# EAGLE design PCB-BI8-SE-E201 (EAGLE 7.5.0)

## Sheet 1 of 2
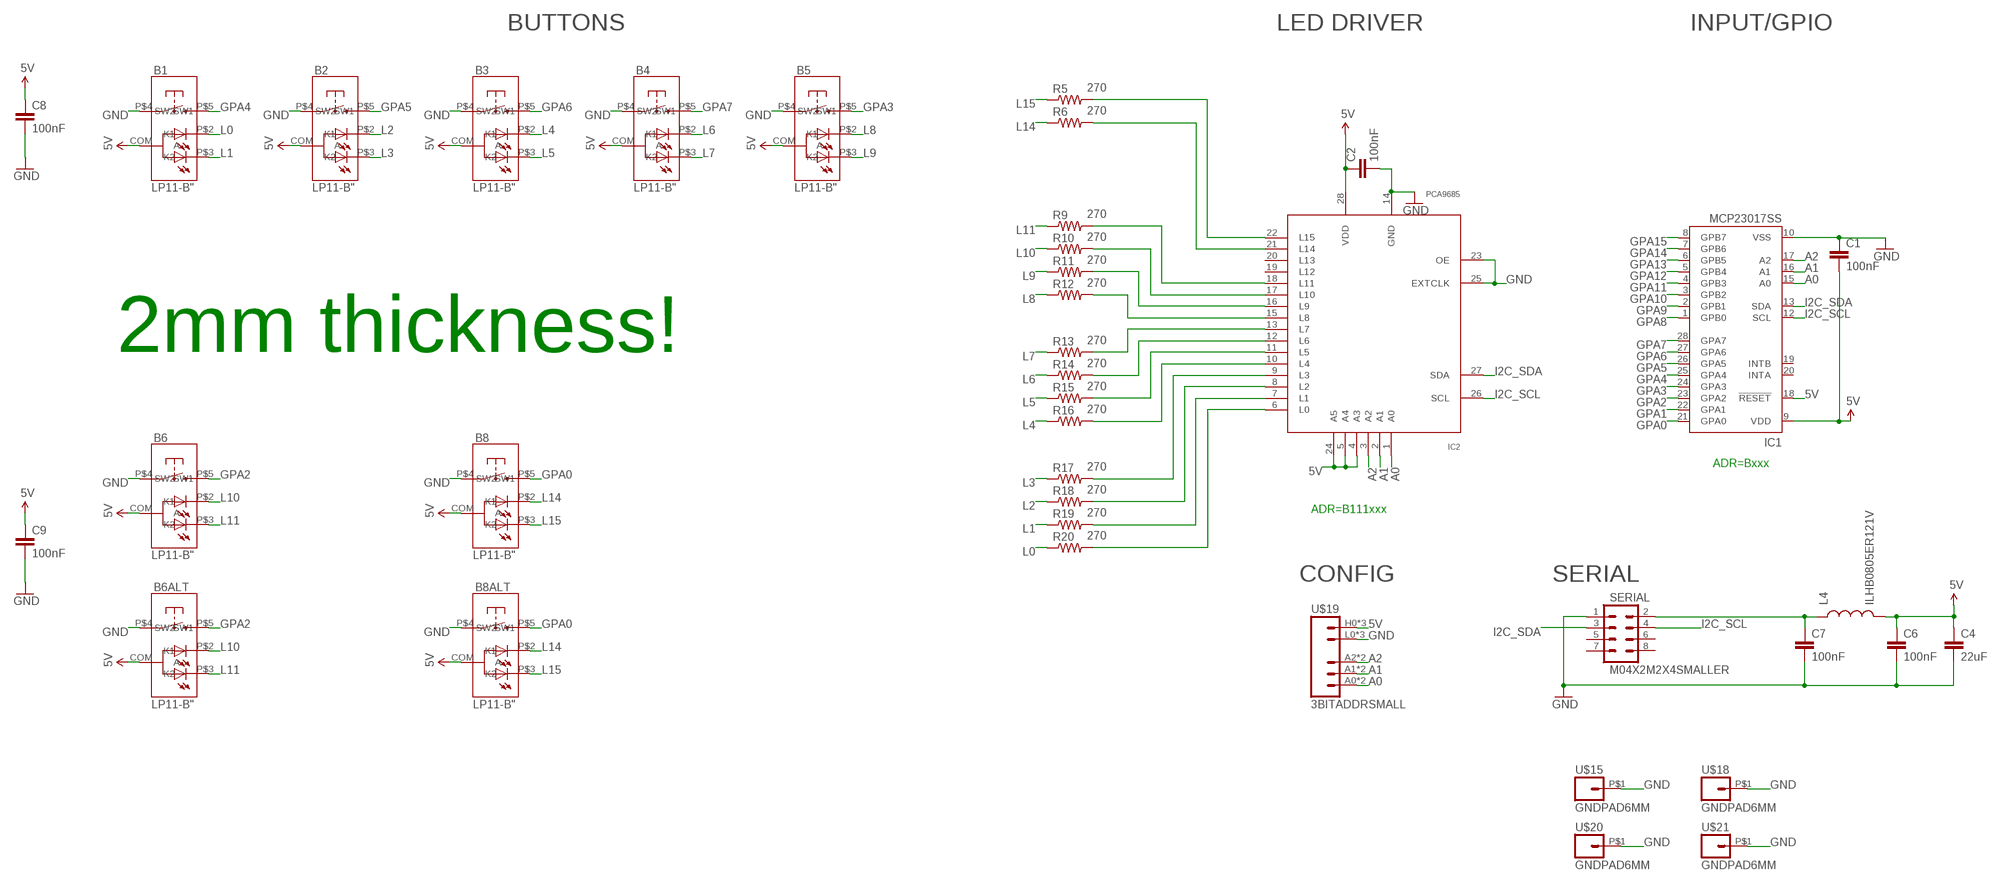
[diagram p0: schematic, sheet 1]

### Parts
B1  LP11-B"  [LP11]
B2  LP11-B"  [LP11]
B3  LP11-B"  [LP11]
B4  LP11-B"  [LP11]
B5  LP11-B"  [LP11]
B6  LP11-B"  [LP11]
B6ALT  LP11-B"  [LP11]
B8  LP11-B"  [LP11]
B8ALT  LP11-B"  [LP11]
C1  100nF  CAP0603-CAP  [0603-CAP]
C2  100nF  CAP0603-CAP  [0603-CAP]
C4  22uF  CAP0805  [0805]
C6  100nF  CAP0603-CAP  [0603-CAP]
C7  100nF  CAP0603-CAP  [0603-CAP]
C8  100nF  CAP0603-CAP  [0603-CAP]
C9  100nF  CAP0603-CAP  [0603-CAP]
IC1  MCP23017SS  [SSOP28]
IC2  PCA9685  [TSSOP28]
L4  ILHB0805ER121V  INDUCTOR0805  [0805]
R5  270  RESISTOR0603-RES  [0603-RES]
R6  270  RESISTOR0603-RES  [0603-RES]
R9  270  RESISTOR0603-RES  [0603-RES]
R10  270  RESISTOR0603-RES  [0603-RES]
R11  270  RESISTOR0603-RES  [0603-RES]
R12  270  RESISTOR0603-RES  [0603-RES]
R13  270  RESISTOR0603-RES  [0603-RES]
R14  270  RESISTOR0603-RES  [0603-RES]
R15  270  RESISTOR0603-RES  [0603-RES]
R16  270  RESISTOR0603-RES  [0603-RES]
R17  270  RESISTOR0603-RES  [0603-RES]
R18  270  RESISTOR0603-RES  [0603-RES]
R19  270  RESISTOR0603-RES  [0603-RES]
R20  270  RESISTOR0603-RES  [0603-RES]
SERIAL  M04X2M2X4SMALLER  [M2X4SMALLER]
U$15  GNDPAD6MM  [3.2MMPAD6MM]
U$18  GNDPAD6MM  [3.2MMPAD6MM]
U$19  3BITADDRSMALL  [3BITADDR_SMALL]
U$20  GNDPAD6MM  [3.2MMPAD6MM]
U$21  GNDPAD6MM  [3.2MMPAD6MM]

### Nets
5V [Power]: B1.COM(A) B2.COM(A) B3.COM(A) B4.COM(A) B5.COM(A) B6.COM(A) B6ALT.COM(A) B8.COM(A) B8ALT.COM(A) C1.2 C2.1 C4.1 C6.1 C8.1 C9.1 IC1.9(VDD) IC1.18(!RESET) IC2.4(A3) IC2.5(A4) IC2.24(A5) IC2.28(VDD) L4.2 U$19.H0(VCC) U$19.H1(VCC) U$19.H2(VCC)
A0: IC1.15(A0) IC2.1(A0) U$19.A0 U$19.AS0(A0)
A1: IC1.16(A1) IC2.2(A1) U$19.A1 U$19.AS1(A1)
A2: IC1.17(A2) IC2.3(A2) U$19.A2 U$19.AS2(A2)
GND [Power]: B1.P$4(SW1) B2.P$4(SW1) B3.P$4(SW1) B4.P$4(SW1) B5.P$4(SW1) B6.P$4(SW1) B6ALT.P$4(SW1) B8.P$4(SW1) B8ALT.P$4(SW1) C1.1 C2.2 C4.2 C6.2 C7.2 C8.2 C9.2 IC1.10(VSS) IC2.14(GND) IC2.23(OE) IC2.25(EXTCLK) SERIAL.1 U$15.P$1 U$18.P$1 U$19.L0(GND) U$19.L1(GND) U$19.L2(GND) U$20.P$1 U$21.P$1
GPA0: B8.P$5(SW2) B8ALT.P$5(SW2) IC1.21(GPA0)
GPA1: IC1.22(GPA1)
GPA2: B6.P$5(SW2) B6ALT.P$5(SW2) IC1.23(GPA2)
GPA3: B5.P$5(SW2) IC1.24(GPA3)
GPA4: B1.P$5(SW2) IC1.25(GPA4)
GPA5: B2.P$5(SW2) IC1.26(GPA5)
GPA6: B3.P$5(SW2) IC1.27(GPA6)
GPA7: B4.P$5(SW2) IC1.28(GPA7)
GPA8: IC1.1(GPB0)
GPA9: IC1.2(GPB1)
GPA10: IC1.3(GPB2)
GPA11: IC1.4(GPB3)
GPA12: IC1.5(GPB4)
GPA13: IC1.6(GPB5)
GPA14: IC1.7(GPB6)
GPA15: IC1.8(GPB7)
I2C_SCL: IC1.12(SCL) IC2.26(SCL) SERIAL.4
I2C_SDA: IC1.13(SDA) IC2.27(SDA) SERIAL.3
L0: B1.P$2(K1) R20.1
L1: B1.P$3(K2) R19.1
L2: B2.P$2(K1) R18.1
L3: B2.P$3(K2) R17.1
L4: B3.P$2(K1) R16.1
L5: B3.P$3(K2) R15.1
L6: B4.P$2(K1) R14.1
L7: B4.P$3(K2) R13.1
L8: B5.P$2(K1) R12.1
L9: B5.P$3(K2) R11.1
L10: B6.P$2(K1) B6ALT.P$2(K1) R10.1
L11: B6.P$3(K2) B6ALT.P$3(K2) R9.1
L14: B8.P$2(K1) B8ALT.P$2(K1) R6.1
L15: B8.P$3(K2) B8ALT.P$3(K2) R5.1
N$1 [Power]: C7.1 L4.1 SERIAL.2
N$4: IC2.13(L7) R13.2
N$5: IC2.12(L6) R14.2
N$7: IC2.11(L5) R15.2
N$9: IC2.10(L4) R16.2
N$10: IC2.9(L3) R17.2
N$11: IC2.8(L2) R18.2
N$12: IC2.7(L1) R19.2
N$19: IC2.6(L0) R20.2
N$20: IC2.15(L8) R12.2
N$21: IC2.16(L9) R11.2
N$22: IC2.17(L10) R10.2
N$23: IC2.18(L11) R9.2
N$26: IC2.21(L14) R6.2
N$27: IC2.22(L15) R5.2
Unconnected: IC1.19(INTB) IC1.20(INTA) IC2.19(L12) IC2.20(L13) SERIAL.5 SERIAL.6 SERIAL.7 SERIAL.8

### Notes on the sheet
- BUTTONS | LED DRIVER | INPUT/GPIO
- 2mm thickness!
- ADR=Bxxx
- ADR=B111xxx
- CONFIG | SERIAL

## Sheet 2 of 2

## Library data of the parts
B1-B6 B6ALT B8 B8ALT = SKAARHOJ:LP11-B
C1 C2 C4 C6-C9 = SparkFun:CAP: Capacitor Standard 0603 ceramic capacitor, and 0.1" leaded capacitor.
IC1 = microchip:MCP23017: http://ww1.microchip.com/downloads/en/DeviceDoc/21952a.pdf Source: http://ww1.microchip.com/downloads/en/DeviceDoc/21952a.pdf; MF: MICROCHIP; MPN: MCP23017-E/SS; OC_FARNELL: 1467674; OC_NEWARK: 31K2960
IC2 = wsmith:PCA9685
L4 = SparkFun:INDUCTOR: Inductors Basic Inductor/Choke - 0603 and 1206. Footprints are not proven and vary greatly between part numbers.
R5 R6 R9-R20 = SparkFun:RESISTOR: Resistor Basic schematic elements and footprints for 0603, 1206, and PTH resistors.
SERIAL = SKAARHOJ:M04X2
U$15 U$18 U$20 U$21 = SKAARHOJ:GNDPAD
U$19 = SKAARHOJ:3BITADDR

## Net classes
0 default: width 0.203 mm, drill 0.406 mm, clearance 0.203 mm
1 Power: width 0.406 mm, drill 0.61 mm, clearance 0.203 mm

## Board
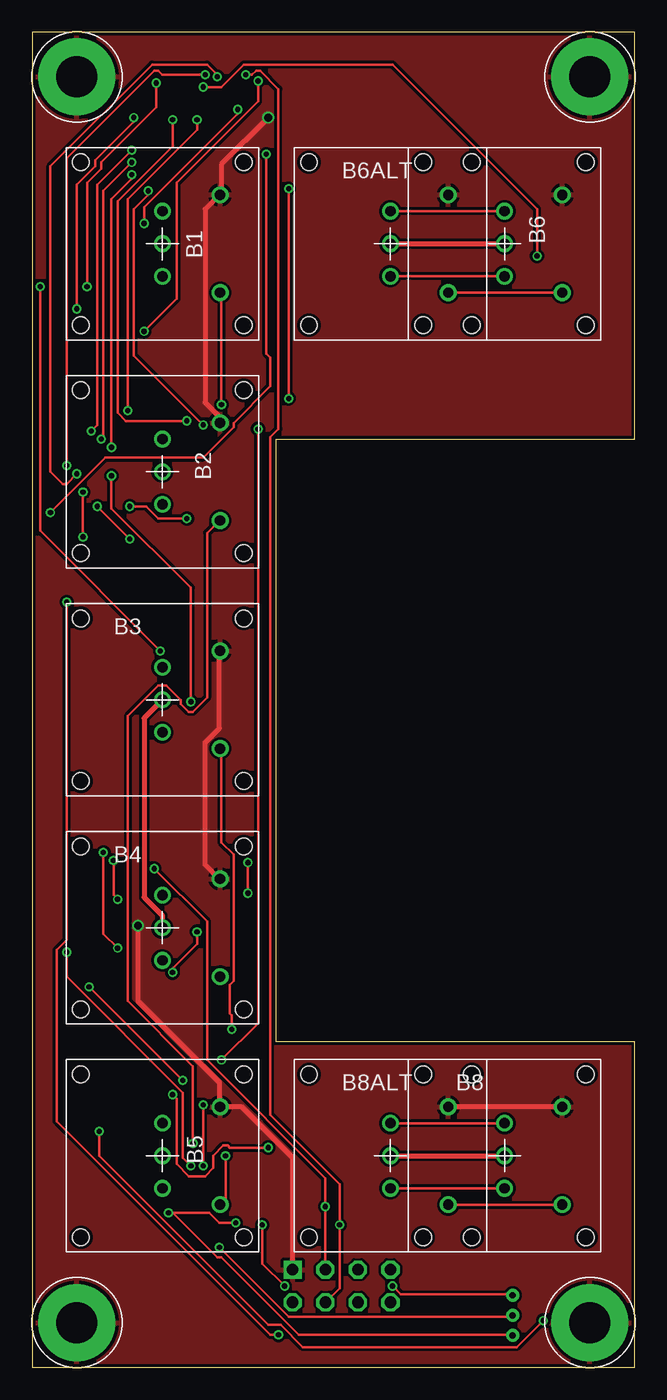
[diagram p1: board, top side]
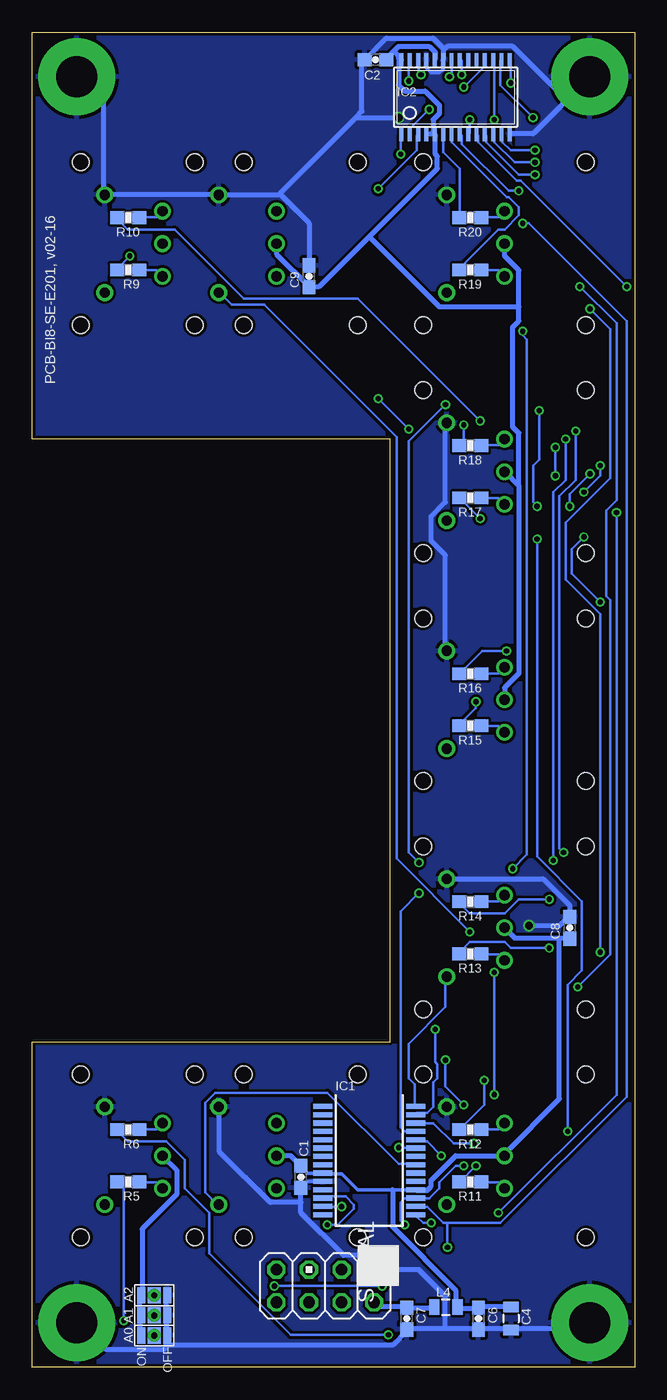
[diagram p2: board, bottom side, seen from below]

Size 46.99 x 104.14 mm. Coordinates in mm from the lower left corner, seen from the top.
Outline: 0,104.14 0,0 46.99,0 46.99,25.4 19.05,25.4 19.05,72.39 46.99,72.39 46.99,104.14 0,104.14
Copper layers (1*16): Top 0.035mm / dielectric 1.5mm / Bottom 0.035mm
Design rules "Fusion_eagle_rule_v1.1": minimum track width 6mil, minimum drill 12mil, track to track 6mil, track to pad 6mil, pad to pad 6mil, via to via 6mil, smd to smd 0mil, copper to edge 10mil, drill to drill 10mil, minimum pad ring 10mil, minimum via ring 6mil, stop-mask expansion 2mil, vias tented up to drill 100mil, thermal gap 10mil

### Footprints (pad centres in the part's own frame; a part is rotated, then mirrored left to right if it is on the bottom)
LP11 = drill 0.8: COM 0,0; P$2 0,2.54; P$3 0,-2.54; P$4 4.5,3.81; P$5 4.5,-3.81 | hole 1.3: -6.35,6.35; 6.35,6.35; 6.35,-6.35; -6.35,-6.35
0603-CAP = smd 1.1 x 1: 1 -0.85,0; 2 0.85,0
0805 = smd 0.8 x 1.2: 1 -0.9,0; 2 0.9,0
SSOP28 = smd 0.4 x 1.5: 1 -4.225,-3.625; 2 -3.575,-3.625; 3 -2.925,-3.625; 4 -2.275,-3.625; 5 -1.625,-3.625; 6 -0.975,-3.625; 7 -0.325,-3.625; 8 0.325,-3.625; 9 0.975,-3.625; 10 1.625,-3.625; 11 2.275,-3.625; 12 2.925,-3.625; 13 3.575,-3.625; 14 4.225,-3.625; 15 4.225,3.625; 16 3.575,3.625; 17 2.925,3.625; 18 2.275,3.625; 19 1.625,3.625; 20 0.975,3.625; 21 0.325,3.625; 22 -0.325,3.625; 23 -0.975,3.625; 24 -1.625,3.625; 25 -2.275,3.625; 26 -2.925,3.625; 27 -3.575,3.625; 28 -4.225,3.625
TSSOP28 = smd 0.305 x 0.991: 1 -4.225,-2.918; 2 -3.575,-2.918; 3 -2.925,-2.918; 4 -2.275,-2.918; 5 -1.625,-2.918; 6 -0.975,-2.918; 7 -0.325,-2.918; 8 0.325,-2.918; 9 0.975,-2.918; 10 1.625,-2.918; 11 2.275,-2.918; 12 2.925,-2.918; 13 3.575,-2.918; 14 4.225,-2.918; 15 4.225,2.918; 16 3.575,2.918; 17 2.925,2.918; 18 2.275,2.918; 19 1.625,2.918; 20 0.975,2.918; 21 0.325,2.918; 22 -0.325,2.918; 23 -0.975,2.918; 24 -1.625,2.918; 25 -2.275,2.918; 26 -2.925,2.918; 27 -3.575,2.918; 28 -4.225,2.918
0603-RES = smd 1.1 x 1: 1 -0.85,0; 2 0.85,0
M2X4SMALLER = drill 0.9 square: 1 -1.27,3.81 | drill 0.9 octagon: 2 1.27,3.81; 3 -1.27,1.27; 4 1.27,1.27; 5 -1.27,-1.27; 6 1.27,-1.27; 7 -1.27,-3.81; 8 1.27,-3.81
3.2MMPAD6MM = drill 3.2 pad 6: P$1 0,0
3BITADDR_SMALL = drill 0.5: A0 -1.565,0; A1 0,0; A2 1.565,0 | smd 1.27 x 1: AS0 -1.565,0; AS1 0,0; AS2 1.565,0 | smd 1.27 x 0.635: H0 -1.565,1; H1 0,1; H2 1.565,1; L0 -1.565,-1; L1 0,-1; L2 1.565,-1

### Placement (x,y rotation side)
B1  10.16,87.63 0 top
B2  10.16,69.85 0 top
B3  10.16,52.07 0 top
B4  10.16,34.29 0 top
B5  10.16,16.51 0 top
B6  36.83,87.63 0 top
B6ALT  27.94,87.63 0 top
B8  36.83,16.51 0 top
B8ALT  27.94,16.51 0 top
C1  26.04,14.86 90 bottom
C2  20.22,101.98 180 bottom
C4  9.65,3.81 270 bottom
C6  12.19,3.81 270 bottom
C7  17.78,3.81 270 bottom
C8  5.08,34.29 90 bottom
C9  25.4,85.09 90 bottom
IC1  20.7,16.13 270 bottom
IC2  13.97,99.06 0 bottom
L4  14.73,4.7 0 bottom
R5  39.5,14.48 180 bottom
R6  39.5,18.54 180 bottom
R9  39.5,85.6 180 bottom
R10  39.5,89.66 180 bottom
R11  12.83,14.48 180 bottom
R12  12.83,18.54 180 bottom
R13  12.83,32.26 180 bottom
R14  12.83,36.32 180 bottom
R15  12.83,50.04 180 bottom
R16  12.83,54.1 180 bottom
R17  12.83,67.82 180 bottom
R18  12.83,71.88 180 bottom
R19  12.83,85.6 180 bottom
R20  12.83,89.66 180 bottom
SERIAL  24.13,6.35 270 bottom
U$15  3.5,100.64 270 top
U$18  3.5,3.5 270 top
U$19  37.47,4.06 90 bottom
U$20  43.49,100.64 270 top
U$21  43.49,3.5 270 top

### Tracks (layer width: path | path; a pad name or v marks a point on that pad's centre or on a via)
5V
  Top 0.406: B8ALT.COM B8.COM | B6ALT.COM B6.COM | B4.COM 10.16,35.24 8.73,36.67 8.73,50.64 B3.COM
  Bottom 0.254: IC1.18 18.89,13.85 21.6,13.85 22.86,15.11 24.29,15.11 IC1.9 25.48,15.15 C1.2
  Bottom 0.406: U$19.H0 38.58,2.54 38.58,3.97 U$19.H1 38.58,4.13 38.58,5.56 U$19.H2 38.42,5.71 38.42,10.79 35.72,13.49 35.72,15.4 B8.COM | 5.87,33.5 9.37,33.5 B4.COM | 5.87,33.5 5.08,33.5 C8.1 | C4.1 9.68,4.76 12.06,4.76 C6.1 12.22,4.6 13.81,4.6 L4.2 13.97,4.76 13.97,6.03 18.89,10.95 18.89,13.85 | IC1.18 16.99,13.81 16.19,13.81 15.88,14.13 15.88,14.61 13.97,16.51 B5.COM 10.16,16.67 5.87,20.95 5.87,33.5 | B8ALT.COM 26.83,16.51 C1.2 | B3.COM 10.16,53.02 9.05,54.13 9.05,68.74 | B2.COM 9.05,68.74 | B1.COM 10.16,86.68 9.05,85.57 9.05,82.71 | 9.05,82.71 9.05,81.6 9.53,81.12 9.53,73.34 9.05,72.87 9.05,68.74 | IC2.5 15.72,96.2 16.19,96.2 IC2.4 | 18.81,102.63 19.37,102.08 C2.1 | 18.81,102.63 18.41,103.03 16.03,103.03 15.56,102.55 15.56,102.08 IC2.24 | 18.81,102.63 18.34,102.16 | 18.34,102.16 18.26,102.08 IC2.28 | IC2.5 15.72,96.36 15.72,97.31 15.24,97.79 15.24,98.42 16.35,99.54 17.94,99.54 18.41,100.01 18.41,102.08 18.34,102.16 | B6ALT.COM 27.94,86.84 25.4,84.3 C9.1 25.24,84.3 24.61,84.3 20.72,88.19 | 20.72,88.19 15.4,93.5 15.4,94.46 15.56,94.61 15.56,96.04 IC2.5 | 9.05,82.71 15.24,82.71 20.72,88.19
A0  (via drill 0.41)
  Top 0.203: v18.26,94.61 18.26,79.06 18.57,78.74 18.57,76.52 15.72,73.66 15.72,73.34 13.34,70.96 5.71,70.96 v1.43,66.67 | 10.95,12.06 13.81,12.06 14.61,11.27 v15.88,11.27 | 10.95,12.06 14.45,8.57 14.76,8.57 20.8,2.54 37.47,2.54 U$19.AS0 | 10.95,12.06 v10.64,12.06
  Bottom 0.203: 37.47,2.54 U$19.AS0 | v18.26,94.61 18.26,96.04 IC2.1 | v1.43,66.67 1.43,21.27 v10.64,12.06 | v15.88,11.27 16.51,11.27 16.99,11.75 IC1.15
A1  (via drill 0.41)
  Top 0.203: v16.03,98.11 16.03,97.79 8.73,90.49 v8.73,89.22 | v14.61,9.37 20,3.97 37.47,3.97 U$19.AS1
  Bottom 0.203: 37.47,4.13 U$19.AS1 | v16.03,98.11 17.46,96.68 17.46,96.2 IC2.2 | v8.73,89.22 8.26,89.22 0.64,81.6 0.64,21.11 10.48,11.27 14.61,11.27 | 14.61,11.27 14.92,11.27 16.19,12.54 16.99,12.54 IC1.16 | 14.61,11.27 v14.61,9.37
A2  (via drill 0.41)
  Top 0.203: v20,75.56 v20,91.92 | v17.62,73.18 17.62,26.83 v14.76,23.97 | v13.34,15.72 v13.34,20.48 | v28.1,6.35 28.73,5.71 37.47,5.71 U$19.AS2 | v19.68,6.35 17.94,8.1 v17.94,11.11
  Bottom 0.203: 37.47,5.56 U$19.AS2 | v20,91.92 16.99,94.93 16.99,96.04 IC2.3 | v17.62,73.18 v20,75.56 | v14.76,23.97 14.76,21.91 v13.34,20.48 | v13.34,15.72 13.97,15.72 15.24,14.45 15.24,13.97 16.03,13.18 16.99,13.18 IC1.17 17.14,13.18 17.94,13.18 18.26,12.86 18.26,11.43 v17.94,11.11 | v19.68,6.35 v28.1,6.35
GND  (via drill 0.61)
  Top 0.406: B8.P$4 B8ALT.P$4 | SERIAL.1 20.32,16.35 16.35,20.32 B5.P$4 14.61,20.48 14.61,22.23 8.26,28.57 v8.26,34.45 | B2.P$4 14.61,73.66 14.61,74.14 13.49,75.25 13.49,90.33 14.61,91.44 B1.P$4 14.76,91.6 14.76,93.82 v18.41,97.47 | B3.P$4 14.61,55.88 14.61,49.85 13.49,48.74 13.49,39.21 14.61,38.1 B4.P$4
  Bottom 0.254: IC1.10 25.54,14.5 C1.1 | IC2.23 14.95,101.26 15.24,100.97 15.88,100.97 16.26,101.35 16.26,101.97 IC2.25
  Bottom 0.406: 26.04,12.86 26.04,12.06 22.7,8.73 21.43,8.73 SERIAL.1 16.83,7.62 14.76,5.56 14.76,3.02 | 26.04,12.86 C1.1 | 26.04,12.86 28.42,12.86 32.38,16.83 32.38,20.32 B8ALT.P$4 | U$19.L2 36.51,5.56 36.51,4.13 U$19.L1 36.51,3.97 36.51,2.54 U$19.L0 36.51,2.38 36.51,1.75 | 36.51,1.75 36.51,1.59 36.67,1.43 41.27,1.43 43.34,3.49 U$21.P$1 | 14.76,3.02 12.38,3.02 C6.2 12.06,3.02 9.68,3.02 C4.2 9.53,3.02 4.13,3.02 3.65,3.49 U$18.P$1 | 14.76,3.02 17.78,3.02 C7.2 17.78,2.86 18.89,1.75 36.51,1.75 | B4.P$4 7.14,38.1 5.08,36.04 C8.2 5.24,35.08 5.87,34.45 v8.26,34.45 | B2.P$4 14.76,73.66 14.76,67.47 15.88,66.36 15.88,64.45 14.76,63.34 14.76,55.88 B3.P$4 | 14.92,102.87 14.92,102.08 IC2.23 | 14.92,102.87 15.72,103.66 19.37,103.66 20.95,102.08 C2.2 21.27,101.92 21.27,97.95 21.67,97.55 | IC2.14 9.68,96.2 7.94,96.2 U$15.P$1 5.4,98.9 9.53,103.03 14.61,103.03 14.76,102.87 14.92,102.87 | C9.2 25.4,89.22 27.62,91.44 | 27.62,91.44 B6ALT.P$4 B6.P$4 41.43,91.6 41.43,98.58 U$20.P$1 | 21.67,97.55 27.62,91.6 27.62,91.44 | v18.41,97.47 21.59,97.47 21.67,97.55
  pour Top: 0,0 46.99,0 46.99,104.14 0,104.14
  pour Bottom: 0,0 46.99,0 46.99,104.14 0,104.14
GPA0
  Top 0.203: B8ALT.P$5 B8.P$5
  Bottom 0.203: IC1.21 17.14,15.88 18.41,15.88 23.97,21.43 32.7,21.43 33.5,20.64 33.5,13.65 32.54,12.7 B8ALT.P$5
GPA2  (via drill 0.41)
  Top 0.203: v18.41,17.14 15.4,17.14 15.24,17.3 14.92,17.3 14.13,16.51 14.13,15.56 13.49,14.92 12.22,14.92 11.27,15.88 11.27,20.95 v10.95,21.27 | v10.95,30.8 10.95,31.11 12.86,33.02 v12.86,33.97 | B6ALT.P$5 B6.P$5
  Bottom 0.203: v18.41,17.14 17.14,17.14 IC1.23 | v10.95,30.8 v10.95,21.27 | v12.86,33.97 18.57,39.69 18.57,72.55 28.89,82.87 31.43,82.87 32.38,83.82 B6ALT.P$5
GPA3  (via drill 0.41)
  Top 0.203: v15.08,16.51 15.08,13.02 14.76,12.7 B5.P$5
  Bottom 0.203: v15.08,16.51 16.19,17.62 16.99,17.62 IC1.24
GPA4  (via drill 0.41)
  Top 0.203: v16.83,39.37 v16.83,36.99 | v14.76,75.09 14.76,83.82 B1.P$5
  Bottom 0.203: v16.83,36.99 18.26,35.56 18.26,18.73 17.94,18.41 17.14,18.41 IC1.25 | v16.83,39.37 17.62,40.16 17.62,72.23 v14.76,75.09
GPA5  (via drill 0.41)
  Top 0.203: v12.54,17.46 12.54,23.5 7.46,28.57 7.46,50.8 9.84,53.18 10.48,53.18 11.59,52.07 11.59,51.75 12.22,51.12 12.54,51.12 13.65,52.23 13.65,65.09 14.61,66.04 B2.P$5
  Bottom 0.203: v12.54,17.46 14.13,17.46 15.72,19.05 16.99,19.05 IC1.26
GPA6  (via drill 0.41)
  Top 0.203: v15.56,26.35 15.56,27.46 15.4,27.62 15.4,29.84 15.72,30.16 15.72,40.01 14.76,40.96 14.76,48.26 B3.P$5
  Bottom 0.203: v15.56,26.35 15.56,23.81 15.4,23.65 15.4,22.54 15.72,22.23 15.72,20.32 16.19,19.84 16.99,19.84 IC1.27
GPA7
  Bottom 0.203: IC1.28 17.14,20.48 17.14,22.07 17.62,22.54 17.62,25.24 14.76,28.1 14.76,30.48 B4.P$5
I2C_SCL  (via drill 0.41)
  Top 0.203: v16.67,100.81 17.14,100.81 17.46,101.12 17.78,101.12 19.21,99.69 19.21,73.18 18.57,72.55 18.57,19.68 23.97,14.29 v23.97,11.11 23.97,6.19 SERIAL.4
  Bottom 0.203: v16.67,100.81 16.83,100.97 16.83,101.92 IC2.26 | v23.97,11.11 23.18,11.11 21.91,12.38 21.91,12.7 22.54,13.34 24.29,13.34 IC1.12
I2C_SDA  (via drill 0.41)
  Top 0.203: v17.62,100.33 17.62,98.74 11.27,92.39 11.27,83.34 v8.73,80.8 | v9.53,38.89 13.65,34.77 13.65,23.97 22.86,14.76 v22.86,12.54 SERIAL.3
  Bottom 0.203: v17.62,100.33 17.62,101.92 IC2.27 | v8.73,80.8 8.73,80.49 8.41,80.17 8.41,40.01 v9.53,38.89 | v22.86,12.54 24.29,12.54 IC1.13
L0
  Bottom 0.203: B1.P$2 10.64,89.69 11.91,89.69 R20.1
L1
  Bottom 0.203: B1.P$3 10.64,85.57 11.91,85.57 R19.1
L2
  Bottom 0.203: B2.P$2 10.64,71.91 11.91,71.91 R18.1
L3
  Bottom 0.203: B2.P$3 10.64,67.79 11.91,67.79 R17.1
L4
  Bottom 0.203: B3.P$2 10.64,54.13 11.91,54.13 R16.1
L5
  Bottom 0.203: B3.P$3 10.64,50.01 11.91,50.01 R15.1
L6
  Bottom 0.203: B4.P$2 10.64,36.35 11.91,36.35 R14.1
L7
  Bottom 0.203: B4.P$3 10.64,32.23 11.91,32.23 R13.1
L8
  Bottom 0.203: B5.P$2 10.64,18.57 11.91,18.57 R12.1
L9
  Bottom 0.203: B5.P$3 10.64,14.45 11.91,14.45 R11.1
L10
  Top 0.203: B6.P$2 B6ALT.P$2
  Bottom 0.203: B6.P$2 37.31,89.69 38.58,89.69 R10.1
L11
  Top 0.203: B6.P$3 B6ALT.P$3
  Bottom 0.203: B6.P$3 37.31,85.57 38.58,85.57 R9.1
L14
  Top 0.203: B8.P$2 B8ALT.P$2
  Bottom 0.203: B8.P$2 37.31,18.57 38.58,18.57 R6.1
L15
  Top 0.203: B8.P$3 B8ALT.P$3
  Bottom 0.203: B8.P$3 37.31,14.45 38.58,14.45 R5.1
N$1
  Bottom 0.406: L4.1 15.72,4.6 17.78,4.6 C7.1 17.94,4.76 20,4.76 SERIAL.2
N$4  (via drill 0.41)
  Top 0.203: v7.78,94.93 5.08,92.23 5.08,73.5 v4.6,73.03 | v5.56,40.16 5.56,33.81 v6.67,32.7
  Bottom 0.203: v7.78,94.93 9.68,94.93 10.32,95.57 10.32,96.04 IC2.13 | v4.6,73.03 4.6,69.22 5.87,67.94 5.87,40.48 v5.56,40.16 | v6.67,32.7 9.68,32.7 10.16,33.18 12.86,33.18 13.65,32.38 R13.2
N$5  (via drill 0.41)
  Top 0.203: v7.78,93.98 5.56,91.76 5.56,72.55 v5.4,72.39 | v6.35,39.53 6.35,36.83 v6.67,36.51
  Bottom 0.203: v7.78,93.98 9.37,93.98 10.95,95.57 10.95,96.04 IC2.12 | v5.4,72.39 5.4,69.22 6.35,68.26 v6.35,39.53 | v6.67,36.51 9.05,36.51 10.16,35.4 12.86,35.4 13.65,36.2 R14.2
N$7  (via drill 0.41)
  Top 0.203: v7.78,93.03 7.78,92.71 6.19,91.12 v6.19,71.75 | v6.19,69.53 6.19,66.99 12.38,60.8 v12.38,51.91
  Bottom 0.203: v7.78,93.03 9.05,93.03 11.59,95.57 11.59,96.04 IC2.11 | v6.19,69.53 v6.19,71.75 | v12.38,51.91 12.38,51.44 13.65,50.16 R15.2
N$9  (via drill 0.41)
  Top 0.203: v0.64,84.3 0.64,65.25 v10,55.88
  Bottom 0.203: v0.64,84.3 8.89,92.55 9.21,92.55 12.22,95.57 12.22,96.04 IC2.10 | v10,55.88 11.91,55.88 13.65,54.13 R16.2
N$10  (via drill 0.41)
  Top 0.203: v12.86,97.31 12.86,96.52 7.46,91.12 v7.46,74.61 | v7.62,67.15 8.89,67.15 9.84,66.2 v12.06,66.2
  Bottom 0.203: v12.86,97.31 12.86,96.2 IC2.9 | v7.46,74.61 7.46,70.8 7.94,70.33 7.94,67.47 v7.62,67.15 | v12.06,66.2 13.65,67.79 R17.2
N$11  (via drill 0.41)
  Top 0.203: v9.05,91.76 9.05,91.44 7.94,90.33 7.94,78.9 v13.34,73.5
  Bottom 0.203: v9.05,91.76 9.84,91.76 13.49,95.41 13.49,96.04 IC2.8 | v13.34,73.5 13.34,72.23 13.65,71.91 R18.2
N$12
  Bottom 0.203: IC2.7 14.29,96.04 14.29,95.57 10,91.28 9.84,91.28 9.05,90.49 9.05,89.85 10.16,88.74 10.64,88.74 13.65,85.72 R19.2
N$19
  Bottom 0.203: IC2.6 14.92,96.04 14.92,94.77 13.65,93.5 13.65,89.69 R20.2
N$20  (via drill 0.41)
  Top 0.203: v9.68,100.17 9.68,98.27 5.4,93.98 5.4,93.5 4.29,92.39 v4.29,84.3 | v11.75,22.38 v4.45,29.69
  Bottom 0.203: v9.68,100.17 9.68,101.92 IC2.15 | v4.29,84.3 1.43,81.44 1.43,67.63 2.22,66.83 2.22,60.17 1.91,59.85 1.91,32.23 v4.45,29.69 | v11.75,22.38 11.75,20.48 13.65,18.57 R12.2
N$21  (via drill 0.41)
  Top 0.203: v7.94,97.47 7.94,97.16 4.92,94.14 4.92,93.66 3.49,92.23 v3.49,82.55 | v2.7,32.38 2.7,30.48 11.75,21.43 11.75,16.35 v12.38,15.72
  Bottom 0.203: v7.94,97.47 10.48,100.01 10.48,101.92 IC2.16 | v3.49,82.55 1.91,80.96 1.91,69.37 5.4,65.88 5.4,61.44 2.7,58.74 v2.7,32.38 | v12.38,15.72 13.65,14.45 R11.2
N$22  (via drill 0.41)
  Top 0.203: v10.95,97.31 10.95,95.25 6.67,90.96 6.67,74.45 7.3,73.82 v12.06,73.82
  Bottom 0.203: v10.95,97.31 10.95,101.92 IC2.17 | v12.06,73.82 21.59,83.34 30.48,83.34 35.88,88.74 39.53,88.74 40.32,89.53 R10.2
N$23  (via drill 0.41)
  Top 0.203: v13.34,99.85 14.76,99.85 16.51,101.6 28.1,101.6 39.37,90.33 v39.37,86.68
  Bottom 0.203: v13.34,99.85 11.75,101.44 11.75,101.92 IC2.18 | v39.37,86.68 40.32,85.72 R9.2
N$26  (via drill 0.41)
  Top 0.203: v13.49,100.81 10.16,100.81 9.84,101.12 9.53,101.12 2.7,94.3 v2.7,70.33 | v3.97,64.77 v3.97,68.26 | v2.7,59.69 2.7,33.34 1.91,32.54 1.91,19.21 18.57,2.54 v19.21,2.54
  Bottom 0.203: v13.49,100.81 13.49,101.92 IC2.21 | v2.7,70.33 2.7,69.53 v3.97,68.26 | v3.97,64.77 4.92,63.82 4.92,61.91 v2.7,59.69 | v19.21,2.54 26.83,2.54 33.18,8.89 33.18,12.06 35.08,13.97 35.08,16.19 36.51,17.62 39.53,17.62 40.32,18.41 R6.2
N$27  (via drill 0.41)
  Top 0.203: v14.45,100.65 14.45,100.81 13.65,101.6 9.37,101.6 1.43,93.66 1.43,69.85 2.38,68.9 2.7,68.9 v3.49,69.69 | v7.62,64.61 v5.08,67.15 | v5.24,18.41 5.24,16.51 18.41,3.33 19.37,3.33 21.11,1.59 37.78,1.59 v39.85,3.65
  Bottom 0.203: v14.45,100.65 14.29,100.81 14.29,101.92 IC2.22 | v3.49,69.69 5.08,68.1 v5.08,67.15 | v7.62,64.61 7.62,39.85 4.13,36.35 4.13,30.96 5.24,29.84 v5.24,18.41 | v39.85,3.65 39.85,13.97 40.32,14.45 R5.2

### Text on the board
_bsilk: PCB-BI8-SE-E201, v02-16